# Altium schematic sheet 535_8POV.SchDoc
size A4; SheetNumber: 17; SheetTotal: 18
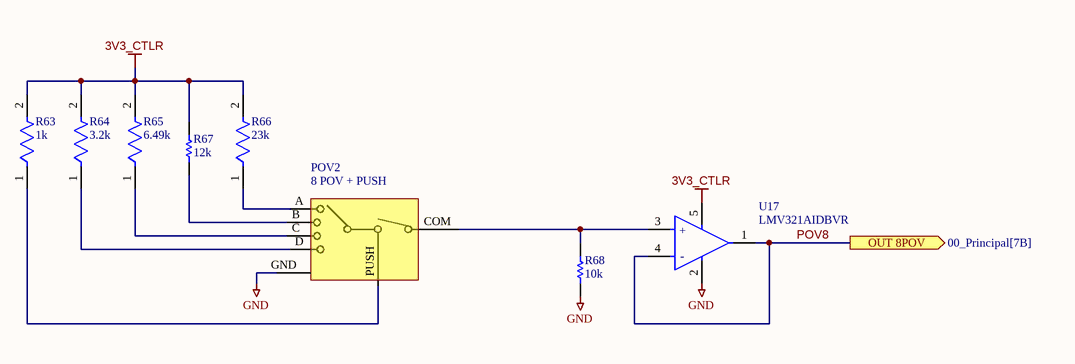
[diagram p0: 535_8POV.SchDoc]

## Parts
POV2  8 POV + PUSH  [RKJXM1015004]
R63  1k  [FP-MCS0402-IPC_B]
R64  3.2k  [FP-RN73R1E-IPC_A]
R65  6.49k  [FP-MCS0402-IPC_A]
R66  23k  [FP-AC0402-MFG]
R67  12k  [RESC0402(1005)_M]
R68  10k  [RESC1005X40X25ML05T05]
U17  LMV321AIDBVR  [FP-DBV0005A-MFG]

## Ports
OUT 8POV (out, see 00_Principal[7B])

## Nets
3V3_CTLR: R63.2 R64.2 R65.2 R66.2 R67.2 U17.5(V+)
GND: POV2.GND R68.1 U17.2(V-)
POV8: U17.1(OUT) U17.4(-IN) ; port OUT 8POV
NetPOV2_A: POV2.A(DIRA) R66.1
NetPOV2_B: POV2.B(DIRB) R67.1
NetPOV2_C: POV2.C(DIRC) R65.1
NetPOV2_COM: POV2.COM R68.2 U17.3(+IN)
NetPOV2_D: POV2.D(DIRD) R64.1
NetPOV2_PUSH: POV2.PUSH R63.1

## Notes on the sheet
- (in symbol CMP-04895-000333-1) +; -

## Library data of the parts
POV2 = RKJXM1015004: 8-directional Stick Switch (with Center-push Function) RKJXM Series
R63 = CMP-2002-02445-2: RES SMD 1.2K OHM 1% 1/10W 0402; Resistance: 1kR; Tolerance: 0.1%; Max Power Dissipation: 63mW; Temperature Coefficient: 25ppm/°C; Max Operating Temperature: 125°C; Min Operating Temperature: -55°C; Case/Package: 0402; Packaging: Tape and Reel; Width: 0.02inch; Lead Free: Lead Free; Number of Terminations: 2; Height: 0.015inch; Package Quantity: 10000; Length: 0.039inch; Composition: Thin Film; Contact Plating: Tin; Depth: 0.5mm; Military Standard: Not
R64 = CMP-04015-034609-1: 3.2kΩ ±0.1% 0.063W, 1/16W Chip Resistor 0402 (1005 Metric) Moisture Resistant Thin Film
R65 = CMP-02407-008176-1: RES SMD 1.2K OHM 1% 1/10W 0402; Temperature Coefficient: 50ppm/°C; Resistance: 6.49kR; Max Power Dissipation: 100mW; Packaging: Tape and Reel; Lead Free: Lead Free; Tolerance: 1%; Case/Package: 0402; Length: 0.039inch; Height: 0.015inch; Package Quantity: 10000; Depth: 0.5mm; Composition: Thin Film; Width: 0.02inch; Min Operating Temperature: -55°C; Number of Terminations: 2; Military Standard: Not; Max Operating Temperature: 155°C
R66 = CMP-03412-015848-2: RES 23.2kΩ ±1% 0.063W 0402; Resistance: 23.2kR; Max Power Dissipation: 63mW; Temperature Coefficient: 100ppm/°C; Features: Moisture Resistant; Military Standard: Not; Max Operating Temperature: 155°C; RoHS Compliant: Yes; Resistor Type: Thick Film; Min Operating Temperature: -55°C; Length: 0.039inch; Height: 0.015inch; Number of Terminations: 2; Width: 0.02inch; Series: AC; Depth: 0.5mm; Tolerance: 1%; Packaging: Tape and Reel; Case/Package: 0402
R67 = CMP-1011-00100-1: 12K 0.063W 5% 0402 (1005 Metric)  SMD; Case-Metric: 1005; Value: 12000.00 Ohm; Case-EIA: 0402; Technology: SMT; Tolerance: 5 %; Power: 0.063 W
R68 = CMP-2002-00601-1: Manufacturer: Panasonic; Part Number: ERJ-2RHD1002X
U17 = CMP-04895-000333-1: IC OPAMP GP 1 CIRCUIT SOT23-5; Input Bias Current: 10pA; Output Current per Channel: 40mA; Gain Bandwidth Product: 1MHz; Input Offset Voltage (Vos): 1mV; Number of Channels: 1; Operating Supply Current: 80uA; Slew Rate: 1.7V/µs; Mount: Surface Mount; Min Operating Temperature: -40°C; Packaging: Cut Tape; Case/Package: SOT-23-5; RoHS Compliant: Yes; Max Operating Temperature: 125°C; Number of Circuits: 1